# Altium schematic sheet 姿态.SchDoc: 姿态
size A4; DocumentNumber: 3; Revision: 樊浩柏; SheetNumber: 3; SheetTotal: 6
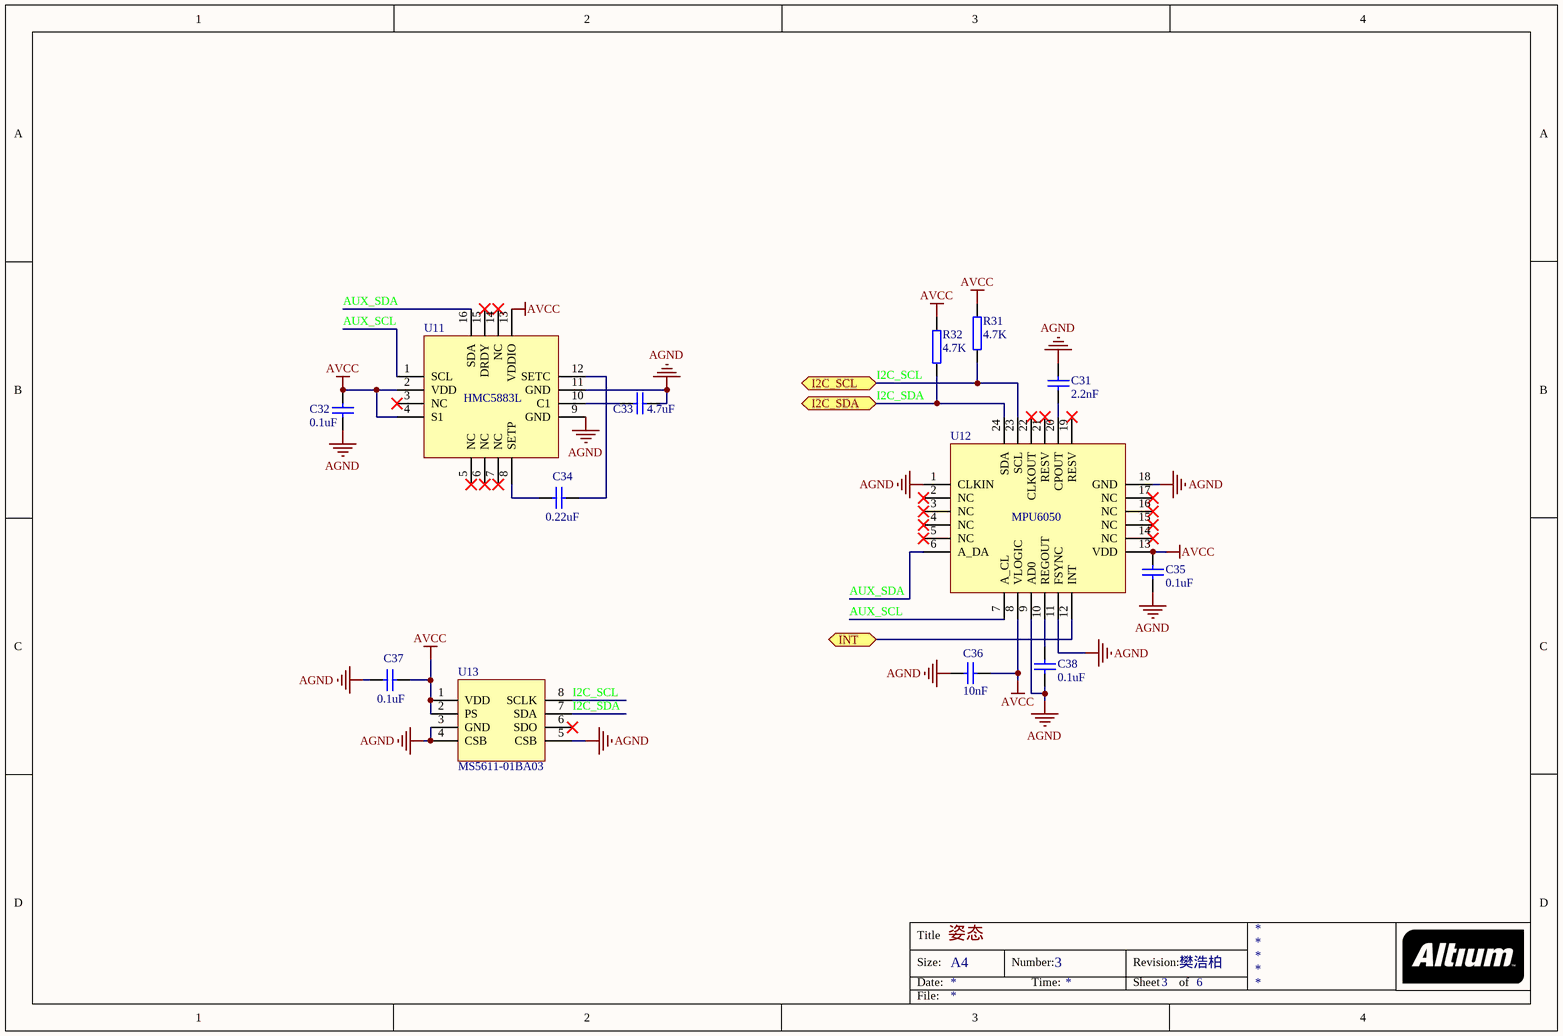
[diagram p0: 姿态.SchDoc]

## Parts
C31  2.2nF  [CAP-0402]
C32  0.1uF  [CAP-0402]
C33  4.7uF  [CAP-0402]
C34  0.22uF  [CAP-0402]
C35  0.1uF  [CAP-0402]
C36  10nF  [CAP-0402]
C37  0.1uF  [CAP-0402]
C38  0.1uF  [CAP-0402]
R31  4.7K  [RES-0402]
R32  4.7K  [RES-0402]
U11  HMC5883L  [QFN-16-3x3MM]
U12  MPU6050  [QFN-24-4x4mm]
U13  MS5611-01BA03  [LGA-8]

## Ports
I2C_SCL, I2C_SDA, INT

## Nets
AGND: C31.2 C32.1 C33.1 C35.1 C36.1 C37.2 C38.1 U11.9(GND) U11.11(GND) U12.1(CLKIN) U12.9(AD0) U12.11(FSYNC) U12.18(GND) U13.3(GND) U13.4(CSB) U13.5(CSB)
AVCC: C32.2 C35.2 C36.2 C37.1 R31.1 R32.1 U11.2(VDD) U11.4(S1) U11.13(VDDIO) U12.8(VLOGIC) U12.13(VDD) U13.1(VDD) U13.2(PS)
AUX_SCL: U11.1(SCL) U12.7(A_CL)
AUX_SDA: U11.16(SDA) U12.6(A_DA)
I2C_SCL: R31.2 U12.23(SCL) U13.8(SCLK) ; port I2C_SCL
I2C_SDA: R32.2 U12.24(SDA) U13.7(SDA) ; port I2C_SDA
INT: U12.12(INT) ; port INT
NetC31_1: C31.1 U12.20(CPOUT)
NetC33_2: C33.2 U11.10(C1)
NetC34_1: C34.1 U11.12(SETC)
NetC34_2: C34.2 U11.8(SETP)
NetC38_2: C38.2 U12.10(REGOUT)

Not connected (* = marked no-connect by the designer): U11 3(NC)* 5(NC)* 6(NC)* 7(NC)* 14(NC)* 15(DRDY)*; U12 2(NC)* 3(NC)* 4(NC)* 5(NC)* 14(NC)* 15(NC)* 16(NC)* 17(NC)* 19(RESV)* 21(RESV)* 22(CLKOUT)*; U13 6(SDO)*

## Notes on the sheet
- Title
- Size:
- Date:
- A4
- Number:
- Time:
- Revision:
- Sheet
- of
- File:

## Library data of the parts
C31-C38 = Cap
R31 R32 = Res
U13 = MS5611